# EAGLE design main (EAGLE 6.2)
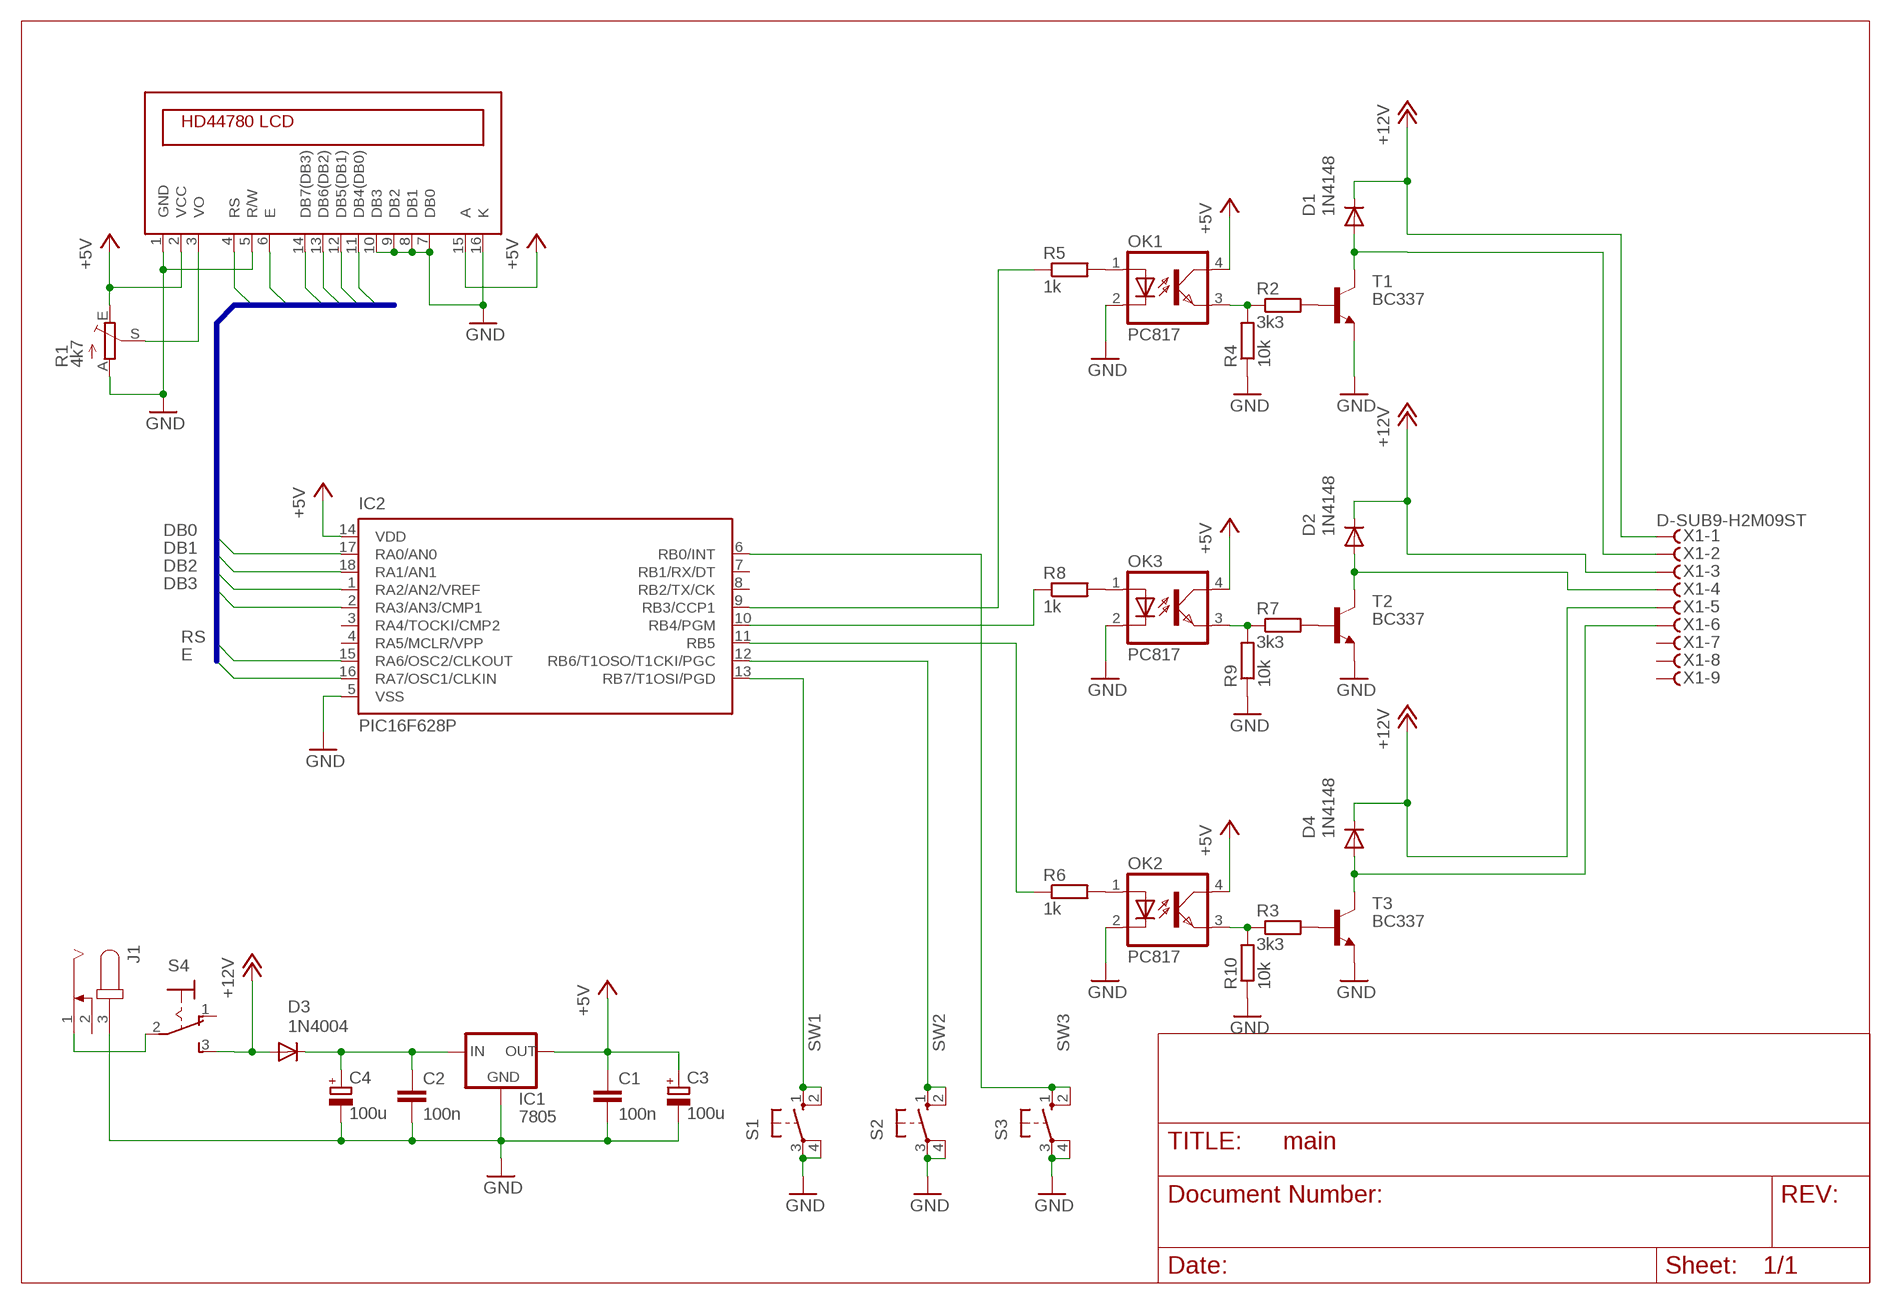
[diagram p0: schematic, sheet 1]

## Parts
C1  100n  C-EU025-025X050  [C025-025X050]
C2  100n  C-EU025-025X050  [C025-025X050]
C3  100u  CPOL-EUE2.5-7  [E2,5-7]
C4  100u  CPOL-EUE2.5-7  [E2,5-7]
D1  1N4148  1N4148DO35-7  [DO35-7]
D2  1N4148  1N4148DO35-7  [DO35-7]
D3  1N4004  [DO41-10]
D4  1N4148  1N4148DO35-7  [DO35-7]
IC1  7805  78XXL  [78XXL]
IC2  PIC16F628P  [DIL18]
J1  JACK-PLUG0  [SPC4077]
OK1  PC817  [DIL04]
OK2  PC817  [DIL04]
OK3  PC817  [DIL04]
R1  4k7  TRIM_EU-CA6V  [CA6V]
R2  3k3  R-EU_0207/10  [0207/10]
R3  3k3  R-EU_0207/10  [0207/10]
R4  10k  R-EU_0207/10  [0207/10]
R5  1k  R-EU_0207/10  [0207/10]
R6  1k  R-EU_0207/10  [0207/10]
R7  3k3  R-EU_0207/10  [0207/10]
R8  1k  R-EU_0207/10  [0207/10]
R9  10k  R-EU_0207/10  [0207/10]
R10  10k  R-EU_0207/10  [0207/10]
S1  10-XX  [B3F-10XX]
S2  10-XX  [B3F-10XX]
S3  10-XX  [B3F-10XX]
S4  320-916  [320-916]
T1  BC337  BC337-40-NPN-TO92-CBE  [TO92-CBE]
T2  BC337  BC337-40-NPN-TO92-CBE  [TO92-CBE]
T3  BC337  BC337-40-NPN-TO92-CBE  [TO92-CBE]
U1  YM1602G_LOWCON  LCD_BL_16X2_LOW  [YM1602G_LOWCON]
X1  D-SUB9-H2M09ST  [H2M09ST]

## Nets
+5V: C1.1 C3.+ IC1.OUT IC2.14(VDD) OK1.4(COL) OK2.4(COL) OK3.4(COL) R1.E U1.2(VCC) U1.15(A)
+12V: D1.C D2.C D3.A D4.C S4.3(S) X1.1 X1.3 X1.5
DB0: IC2.17(RA0/AN0) U1.11(DB4(DB0))
DB1: IC2.18(RA1/AN1) U1.12(DB5(DB1))
DB2: IC2.1(RA2/AN2/VREF) U1.13(DB6(DB2))
DB3: IC2.2(RA3/AN3/CMP1) U1.14(DB7(DB3))
E: IC2.16(RA7/OSC1/CLKIN) U1.6(E)
GND: C1.2 C2.2 C3.- C4.- IC1.GND IC2.5(VSS) J1.3 OK1.2(C) OK2.2(C) OK3.2(C) R1.A R4.1 R9.1 R10.1 S1.3(P) S1.4(P1) S2.3(P) S2.4(P1) S3.3(P) S3.4(P1) T1.E T2.E T3.E U1.1(GND) U1.5(R/W) U1.7(DB0) U1.8(DB1) U1.9(DB2) U1.10(DB3) U1.16(K)
N$1: R2.2 T1.B
N$2: D1.A T1.C X1.2
N$3: C2.1 C4.+ D3.C IC1.IN
N$4: OK2.1(A) R6.2
N$5: D2.A T2.C X1.4
N$6: IC2.9(RB3/CCP1) R5.1
N$7: IC2.11(RB5) R6.1
N$8: R3.2 T3.B
N$9: D4.A T3.C X1.6
N$10: IC2.10(RB4/PGM) R8.1
N$11: R1.S U1.3(VO)
N$12: J1.1 S4.2(P)
N$13: OK1.1(A) R5.2
N$14: OK1.3(EMIT) R2.1 R4.2
N$15: OK2.3(EMIT) R3.1 R10.2
N$16: OK3.1(A) R8.2
N$17: R7.2 T2.B
N$18: OK3.3(EMIT) R7.1 R9.2
RS: IC2.15(RA6/OSC2/CLKOUT) U1.4(RS)
SW1: IC2.13(RB7/T1OSI/PGD) S1.1(S) S1.2(S1)
SW2: IC2.12(RB6/T1OSO/T1CKI/PGC) S2.1(S) S2.2(S1)
SW3: IC2.6(RB0/INT) S3.1(S) S3.2(S1)
Unconnected: IC2.3(RA4/TOCKI/CMP2) IC2.4(RA5/MCLR/VPP) IC2.7(RB1/RX/DT) IC2.8(RB2/TX/CK) J1.2 S4.1(O) X1.7 X1.8 X1.9

## Buses
RS,E,DB[0..3]

## Library data of the parts
C1 C2 = rcl:C-EU: CAPACITOR, European symbol
C3 C4 = rcl:CPOL-EU: POLARIZED CAPACITOR, European symbol
D1 D2 D4 = diode:1N4148: DIODE high speed (Philips)
D3 = diode:1N4004: DIODE general purpose rectifier, 1 A
IC1 = v-reg:78XXL: VOLTAGE REGULATOR
IC2 = microchip:PIC16F62*: FLASH-Based 8-Bit CMOS Microcontroller Source: http://ww1.microchip.com/downloads/en/DeviceDoc/40300C.pdf; MF: MICROCHIP; MPN: PIC16F628-04I/P; OC_FARNELL: 9760407; OC_NEWARK: 19C7272
J1 = con-jack:JACK-PLUG: DC POWER JACK Power Jack, DC, Right Angle, Through Hole, Rated 5A at 16VDC, PC Terminals Distributor: Farnell (www.Farnell.de) Drawing: 84N1161.pdf / 84N1162.pdf Manufacturer: SPC Technology (www.spctechnology.com) Type: SPC4077 / SPC 4078; OC_FARNELL: unknown; OC_NEWARK: unknown
OK1-OK3 = optocoupler:PC817: SHARP OPTO COUPLER; MPN: PC817X4J000F; OC_FARNELL: 9707727; OC_NEWARK: 97K7059
R1 = pot:TRIM_EU-: POTENTIOMETER
R2-R10 = rcl:R-EU_: RESISTOR, European symbol
S1-S3 = switch-omron:10-XX: OMRON SWITCH; MPN: B3F-1000; OC_FARNELL: 176432; OC_NEWARK: 36M3542
S4 = switch:320-916: TOGGLE SWITCH distributor RS Components
T1-T3 = transistor:*-NPN-: NPN Transistror BF959 corrected 2008.03.06
U1 = lcdmodules2:LCD_BL_16X2
X1 = con-thomas-betts:D-SUB9-: D-Subminiatur Connector Source: Electronioc Interconnects European Edition 1998; OC_FARNELL: unknown; OC_NEWARK: unknown

## Net classes
0 default: width 0.8 mm, drill 0.8 mm, clearance 0.5 mm

## Board
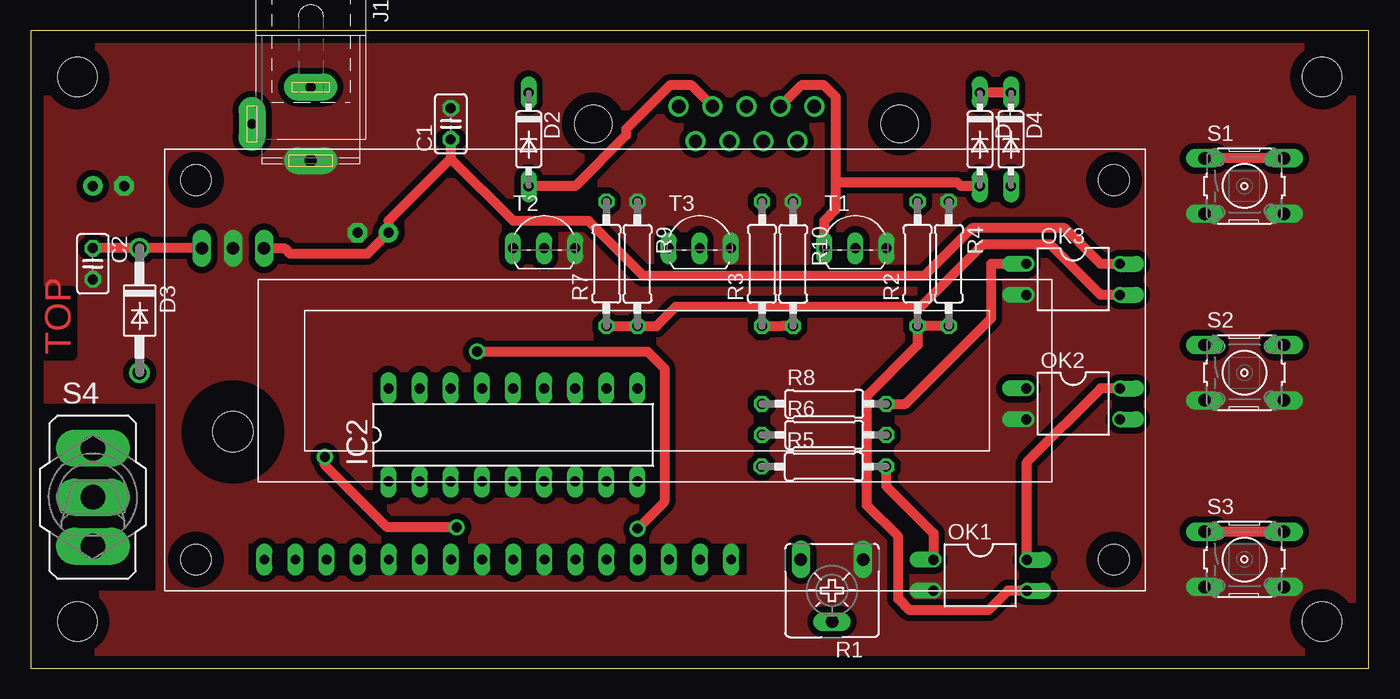
[diagram p1: board, top side]
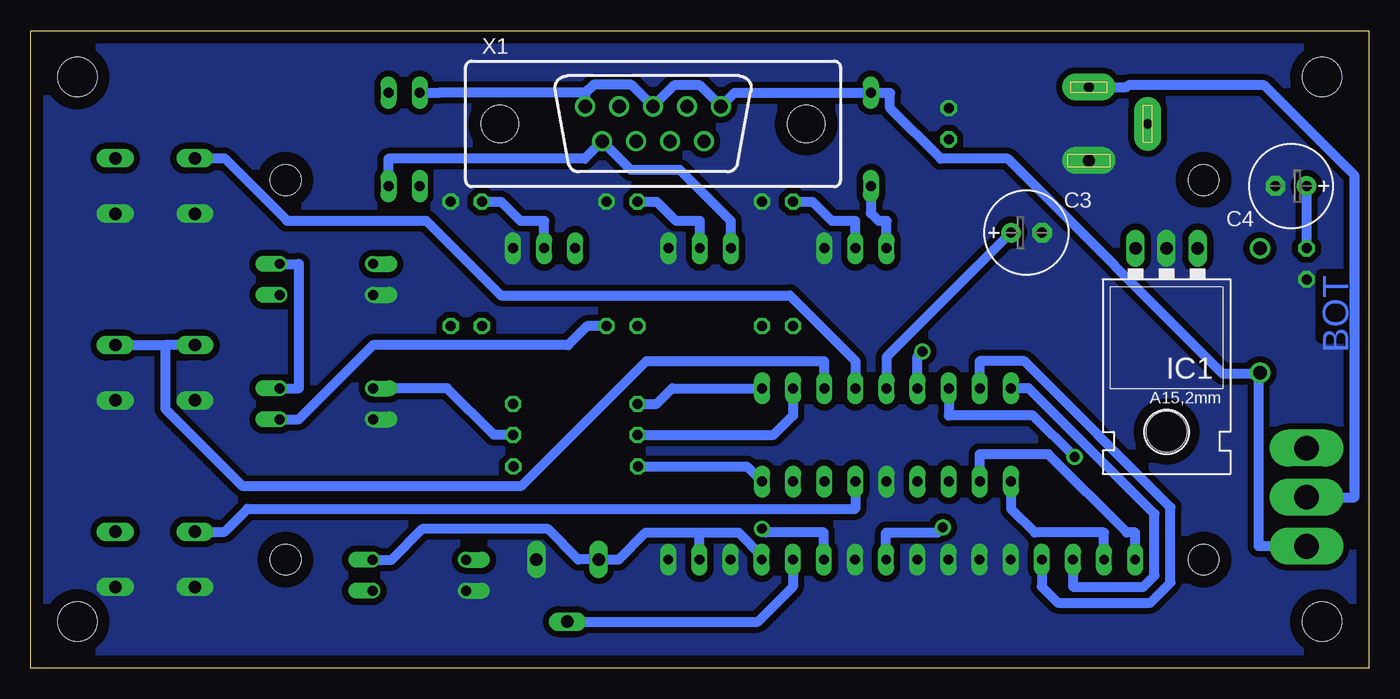
[diagram p2: board, bottom side, seen from below]

Size 109.22 x 52.06 mm. Coordinates in mm from the lower left corner, seen from the top.
Outline: 0,0 109.22,0 109.22,52.06 0,52.06 0,0
Copper layers (1*16): Top 0.035mm / dielectric 1.5mm / Bottom 0.035mm
Design rules: minimum track width 0.8mm, minimum drill 0.8mm, track to track 0.5mm, track to pad 0.5mm, pad to pad 8mil, via to via 8mil, smd to smd 8mil, copper to edge 40mil, drill to drill 8mil, minimum pad ring 10mil, minimum via ring 10mil, stop-mask expansion 4mil, vias tented up to drill 0mil, thermal gap 10mil
Holes 3.2 mm at 3.81,3.81 105.41,3.81 105.41,48.26 3.81,48.26
tRestrict: area 17.8,7.6 to 58.4,10.2; area 27.9,14 to 50.8,24.1; area 1.3,6.3 to 10.2,21.6

### Footprints (pad centres in the part's own frame; a part is rotated, then mirrored left to right if it is on the bottom)
C025-025X050 = drill 0.813 octagon: 1 -1.27,0; 2 1.27,0
E2,5-7 = drill 0.813 pad 1.6: + -1.27,0 | drill 0.813 pad 1.6 octagon: - 1.27,0
DO35-7 = drill 0.813 long: A 3.81,0; C -3.81,0
DO41-10 = drill 1.118: A 5.08,0; C -5.08,0
78XXL = drill 1.016 long: GND 0,-3.81; IN -2.54,-3.81; OUT 2.54,-3.81 | hole 3.302: 0,11.176
DIL18 = drill 0.813 long: 1 -10.16,-3.81; 2 -7.62,-3.81; 3 -5.08,-3.81; 4 -2.54,-3.81; 5 0,-3.81; 6 2.54,-3.81; 7 5.08,-3.81; 8 7.62,-3.81; 9 10.16,-3.81; 10 10.16,3.81; 11 7.62,3.81; 12 5.08,3.81; 13 2.54,3.81; 14 0,3.81; 15 -2.54,3.81; 16 -5.08,3.81; 17 -7.62,3.81; 18 -10.16,3.81
SPC4077 = drill 0.8 pad 2.184 long: 1 -3,0; 2 0,-4.8 | drill 1 pad 2.184 long: 3 3,0
DIL04 = drill 0.813 offset: 1 -1.27,-3.81; 2 1.27,-3.81; 3 1.27,3.81; 4 -1.27,3.81
CA6V = drill 1.016 long: A -2.54,-2.54; E 2.54,-2.54; S 0,2.54
0207/10 = drill 0.813 octagon: 1 -5.08,0; 2 5.08,0
B3F-10XX = drill 1.016 long: 1 -3.251,2.261; 2 3.251,2.261; 3 -3.251,-2.261; 4 3.251,-2.261
320-916 = drill 2.007 long: 1 0,4.013; 2 0,0; 3 0,-4.013
TO92-CBE = drill 0.813 long: B 0,0; C -2.54,0; E 2.54,0
YM1602G_LOWCON = drill 0.8 long: 1 1.905,-15.875; 2 -0.635,-15.875; 3 -3.175,-15.875; 4 -5.715,-15.875; 5 -8.255,-15.875; 6 -10.795,-15.875; 7 -13.335,-15.875; 8 -15.875,-15.875; 9 -18.415,-15.875; 10 -20.955,-15.875; 11 -23.495,-15.875; 12 -26.035,-15.875; 13 -28.575,-15.875; 14 -31.115,-15.875; 15 4.445,-15.875; 16 6.985,-15.875 | hole 2.5: -36.703,15.113; -36.703,-15.875; 38.227,-15.875; 38.227,15.113
H2M09ST = drill 1.092: 1 -5.537,1.422; 2 -2.769,1.422; 3 0,1.422; 4 2.769,1.422; 5 5.537,1.422; 6 -4.153,-1.422; 7 -1.384,-1.422; 8 1.384,-1.422; 9 4.153,-1.422 | hole 3.048: -12.497,0; 12.497,0

### Placement (x,y rotation side)
C1  34.29,44.45 90 top
C2  5.08,33.02 270 top
C3  27.94,35.56 0 bottom
C4  6.35,39.37 180 bottom
D1  77.47,43.18 270 top
D2  40.64,43.18 270 top
D3  8.89,29.21 270 top
D4  80.01,43.18 270 top
IC1  16.51,30.48 180 bottom
IC2  39.37,19.05 0 top
J1  22.86,44.45 270 top
OK1  77.51,7.59 270 top
OK2  85.09,21.59 270 top
OK3  85.09,31.75 270 top
R1  65.41,6.35 180 top
R2  72.39,33.02 90 top
R3  59.69,33.02 90 top
R4  74.93,33.02 270 top
R5  64.74,16.47 0 top
R6  64.77,19.05 0 top
R7  46.99,33.02 90 top
R8  64.77,21.59 0 top
R9  49.53,33.02 270 top
R10  62.23,33.02 270 top
S1  99.06,39.37 0 top
S2  99.06,24.13 0 top
S3  99.06,8.89 0 top
S4  5.08,13.97 0 top
T1  67.31,34.29 0 top
T2  41.91,34.29 0 top
T3  54.61,34.29 0 top
U1  50.19,24.74 0 top
X1  58.42,44.45 0 bottom

### Tracks (layer width: path | path; a pad name or v marks a point on that pad's centre or on a via)
+5V
  Top 0.8: OK2.4 87.34,22.86 81.32,16.84 OK1.4 | OK3.4 87.34,33.02 84.42,35.93 76.82,35.93 72.92,32.04 50.03,32.04 45.55,36.51 39.4,36.51 34.29,41.62 | IC1.OUT 20.71,34.29 21.18,33.82 27.47,33.82 C3.+ 29.21,36.54 34.29,41.62 | C1.1 34.29,41.62
  Bottom 0.8: 54.64,11.08 59.02,11.08 61.2,8.89 R1.E 64.53,8.89 67,11.37 77.26,11.37 79.76,8.87 OK1.4 | 54.64,11.08 54.64,10.75 U1.15 | 54.64,11.08 51.45,11.08 49.55,9.19 U1.2 | OK2.4 87.34,22.86 87.34,33.02 OK3.4 | C3.+ 39.37,25.4 IC2.14
+12V
  Top 0.8: D4.C D1.C
  Bottom 0.8: 63.96,46.99 75.91,46.99 D1.C | 63.96,46.99 63.3,47.65 60.19,47.65 X1.3 56.7,47.59 54.6,47.59 X1.5 51.77,46.99 D2.C 39.08,46.99 39.08,45.74 34.94,41.59 29.48,41.59 11.92,24.03 8.99,24.03 | 63.96,46.99 X1.1 | 8.99,24.03 D3.A | 8.99,24.03 8.99,9.96 S4.3
DB0
  Bottom 0.8: IC2.17 31.75,25.08 28.13,25.08 16.18,13.13 16.18,6.99 17.82,5.36 25.39,5.36 26.7,6.66 U1.11
DB1
  Bottom 0.8: U1.12 24.16,6.66 18.4,6.66 17.51,7.55 17.51,12.62 27.75,22.86 IC2.18
DB2
  Bottom 0.8: IC2.1 29.21,13.02 27.27,11.08 21.61,11.08 U1.13
DB3
  Bottom 0.8: IC2.2 31.75,17.46 26.15,17.46 19.76,11.08 19.07,11.08 U1.14
E  (via drill 0.8 pad 1.31)
  Top 0.8: v34.78,11.51 29.11,11.51 24.02,16.6 v24.02,17.25
  Bottom 0.8: U1.6 39.4,11.08 35.21,11.08 v34.78,11.51 | IC2.16 34.29,20.64 27.41,20.64 v24.02,17.25
GND
  pour Bottom (no thermals): 0,52.07 0,0 111.76,0 111.76,52.07
  pour Top (no thermals): 0,52.07 0,0 111.76,0 111.76,52.07
N$1
  Bottom 0.8: R2.2 70.83,38.1 69.24,36.51 67.31,36.51 T1.B
N$2
  Top 0.8: 65.69,39.69 65.69,37.43 64.77,36.51 T1.C | X1.2 62.96,47.64 64.7,47.64 65.69,46.65 65.69,39.69 | 65.69,39.69 75.59,39.69 75.91,39.37 D1.A
N$3
  Top 0.8: C2.1 D3.C IC1.IN
  Bottom 0.8: C2.1 C4.+
N$4
  Bottom 0.8: R6.2 71.41,19.05 75.22,22.86 OK2.1
N$5
  Top 0.8: X1.4 53.92,47.6 52.18,47.6 48.61,44.03 48.61,43.52 44.46,39.37 D2.A
  Bottom 0.8: T2.C 39.37,36.51 40,36.51 40.64,37.15 D2.A
N$6
  Bottom 0.8: R5.1 50.76,16.47 IC2.9
N$7
  Bottom 0.8: IC2.11 46.99,20.64 48.58,19.05 R6.1
N$8
  Bottom 0.8: R3.2 58.13,38.1 56.54,36.51 54.61,36.51 T3.B
N$9
  Bottom 0.8: T3.C 52.07,36.51 56.23,40.67 60.22,40.67 X1.6 64.01,41.59 80.01,41.59 D4.A
N$10
  Bottom 0.8: R8.1 58.13,21.59 56.86,22.86 IC2.10
N$11
  Bottom 0.8: U1.3 47.02,6.66 49.87,3.81 R1.S
N$12
  Bottom 0.8: J1.1 19.78,47.45 19.63,47.6 8.55,47.6 1.17,40.22 1.17,13.97 S4.2
N$13
  Top 0.8: R5.2 69.82,14.91 73.7,11.03 OK1.1
N$14
  Top 0.8: OK1.3 79.76,6.33 78.17,4.73 71.74,4.73 70.82,5.65 70.82,10.75 68.25,13.31 68.25,22.24 72.39,26.38 R2.1 R4.2
N$15
  Top 0.8: R10.2 61.25,27.94 R3.1
  Bottom 0.8: OK2.3 87.34,20.32 81.28,26.38 65.35,26.38 63.79,27.94 R10.2
N$16
  Top 0.8: OK3.1 78.4,33.02 78.4,28.58 71.41,21.59 R8.2
N$17
  Bottom 0.8: R7.2 45.43,38.1 43.84,36.51 41.91,36.51 T2.B
N$18
  Top 0.8: OK3.3 87.34,30.48 83.22,34.6 77.71,34.6 72.62,29.5 52.65,29.5 51.09,27.94 R9.2 R7.1
RS  (via drill 0.8 pad 1.31)
  Top 0.8: v36.43,25.86 50.35,25.86 51.72,24.49 51.72,13.59 v49.53,11.4
  Bottom 0.8: U1.4 44.48,11.08 49.21,11.08 v49.53,11.4 | IC2.15 36.83,25.46 v36.43,25.86
SW1
  Top 0.8: S1.2 S1.1
  Bottom 0.8: S1.1 93.38,41.63 88.29,36.54 76.93,36.54 70.83,30.44 47.25,30.44 41.91,25.1 IC2.13
SW2
  Bottom 0.8: S2.2 98.23,26.39 | IC2.12 44.45,25.08 58.97,25.08 69.15,14.9 91.96,14.9 98.23,21.17 98.23,26.39 | S2.1 98.23,26.39
SW3
  Top 0.8: S3.2 S3.1
  Bottom 0.8: IC2.6 41.91,13.02 91.52,13.02 93.38,11.15 S3.1

### Text on the board
Top: TOP
Bottom: BOT